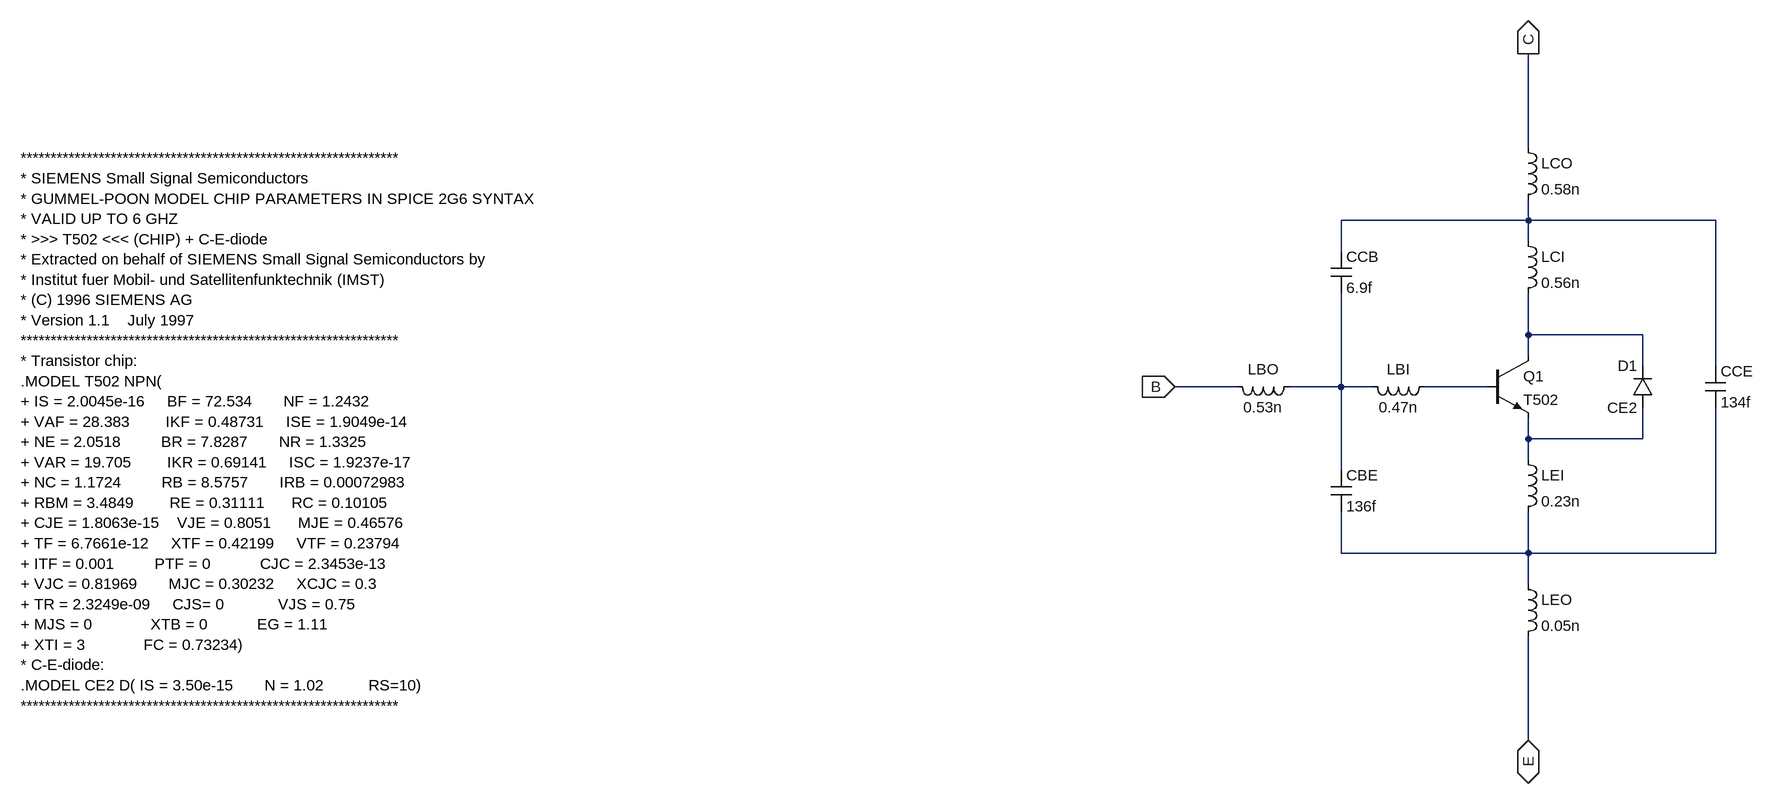
[diagram p0: schematic transistor.asc]
transistor.asc, the LTspice schematic file:
Version 4.1
SHEET 1 2192 680
WIRE 1840 -416 1840 -560
WIRE 1840 -304 1840 -336
WIRE 1840 -304 1552 -304
WIRE 2128 -304 1840 -304
WIRE 1840 -272 1840 -304
WIRE 1552 -256 1552 -304
WIRE 1840 -128 1840 -192
WIRE 2016 -128 1840 -128
WIRE 1840 -96 1840 -128
WIRE 2016 -80 2016 -128
WIRE 2128 -80 2128 -304
WIRE 1392 -48 1296 -48
WIRE 1552 -48 1552 -192
WIRE 1552 -48 1472 -48
WIRE 1600 -48 1552 -48
WIRE 1776 -48 1680 -48
WIRE 1840 32 1840 0
WIRE 2016 32 2016 -16
WIRE 2016 32 1840 32
WIRE 1840 64 1840 32
WIRE 1552 80 1552 -48
WIRE 1552 208 1552 144
WIRE 1840 208 1840 144
WIRE 1840 208 1552 208
WIRE 2128 208 2128 -16
WIRE 2128 208 1840 208
WIRE 1840 256 1840 208
WIRE 1840 496 1840 336
FLAG 1840 496 E
IOPIN 1840 496 BiDir
FLAG 1296 -48 B
IOPIN 1296 -48 In
FLAG 1840 -560 C
IOPIN 1840 -560 Out
SYMBOL npn 1776 -96 R0
SYMATTR InstName Q1
SYMATTR Value T502
SYMBOL ind 1824 48 R0
SYMATTR InstName LEI
SYMATTR Value 0.23n
SYMBOL ind 1824 240 R0
SYMATTR InstName LEO
SYMATTR Value 0.05n
SYMBOL ind 1824 -288 R0
SYMATTR InstName LCI
SYMATTR Value 0.56n
SYMBOL ind 1824 -432 R0
SYMATTR InstName LCO
SYMATTR Value 0.58n
SYMBOL ind 1696 -64 R90
WINDOW 0 5 56 VBottom 2
WINDOW 3 32 56 VTop 2
SYMATTR InstName LBI
SYMATTR Value 0.47n
SYMBOL ind 1488 -64 R90
WINDOW 0 5 56 VBottom 2
WINDOW 3 32 56 VTop 2
SYMATTR InstName LBO
SYMATTR Value 0.53n
SYMBOL cap 2112 -80 R0
SYMATTR InstName CCE
SYMATTR Value 134f
SYMBOL cap 1536 -256 R0
SYMATTR InstName CCB
SYMATTR Value 6.9f
SYMBOL cap 1536 80 R0
SYMATTR InstName CBE
SYMATTR Value 136f
SYMBOL diode 2032 -16 R180
WINDOW 0 24 64 Left 2
WINDOW 3 24 0 Left 2
SYMATTR InstName D1
SYMATTR Value CE2
TEXT -480 -400 Left 2 !***************************************************************\n* SIEMENS Small Signal Semiconductors\n* GUMMEL-POON MODEL CHIP PARAMETERS IN SPICE 2G6 SYNTAX\n* VALID UP TO 6 GHZ\n* >>> T502 <<< (CHIP) + C-E-diode\n* Extracted on behalf of SIEMENS Small Signal Semiconductors by\n* Institut fuer Mobil- und Satellitenfunktechnik (IMST)\n* (C) 1996 SIEMENS AG\n* Version 1.1    July 1997\n***************************************************************\n* Transistor chip:\n.MODEL T502 NPN(\n+ IS = 2.0045e-16     BF = 72.534       NF = 1.2432\n+ VAF = 28.383        IKF = 0.48731     ISE = 1.9049e-14\n+ NE = 2.0518         BR = 7.8287       NR = 1.3325\n+ VAR = 19.705        IKR = 0.69141     ISC = 1.9237e-17\n+ NC = 1.1724         RB = 8.5757       IRB = 0.00072983\n+ RBM = 3.4849        RE = 0.31111      RC = 0.10105\n+ CJE = 1.8063e-15    VJE = 0.8051      MJE = 0.46576\n+ TF = 6.7661e-12     XTF = 0.42199     VTF = 0.23794\n+ ITF = 0.001         PTF = 0           CJC = 2.3453e-13\n+ VJC = 0.81969       MJC = 0.30232     XCJC = 0.3\n+ TR = 2.3249e-09     CJS= 0            VJS = 0.75\n+ MJS = 0             XTB = 0           EG = 1.11\n+ XTI = 3             FC = 0.73234)\n* C-E-diode:\n.MODEL CE2 D( IS = 3.50e-15       N = 1.02          RS=10)\n***************************************************************

The netlist it stands for:
* transistor.asc
Q1 N002 N004 N005 0 T502
LEI N005 N006 0.23n
LEO N006 E 0.05n
LCI N001 N002 0.56n
LCO C N001 0.58n
LBI N004 N003 0.47n
LBO N003 B 0.53n
CCE N001 N006 134f
CCB N001 N003 6.9f
CBE N003 N006 136f
D1 N005 N002 CE2
.model D D
.lib standard.dio
.model NPN NPN
.model PNP PNP
.lib standard.bjt
***************************************************************
* SIEMENS Small Signal Semiconductors
* GUMMEL-POON MODEL CHIP PARAMETERS IN SPICE 2G6 SYNTAX
* VALID UP TO 6 GHZ
* >>> T502 <<< (CHIP) + C-E-diode
* Extracted on behalf of SIEMENS Small Signal Semiconductors by
* Institut fuer Mobil- und Satellitenfunktechnik (IMST)
* (C) 1996 SIEMENS AG
* Version 1.1    July 1997
***************************************************************
* Transistor chip:
.MODEL T502 NPN(
+ IS = 2.0045e-16     BF = 72.534       NF = 1.2432
+ VAF = 28.383        IKF = 0.48731     ISE = 1.9049e-14
+ NE = 2.0518         BR = 7.8287       NR = 1.3325
+ VAR = 19.705        IKR = 0.69141     ISC = 1.9237e-17
+ NC = 1.1724         RB = 8.5757       IRB = 0.00072983
+ RBM = 3.4849        RE = 0.31111      RC = 0.10105
+ CJE = 1.8063e-15    VJE = 0.8051      MJE = 0.46576
+ TF = 6.7661e-12     XTF = 0.42199     VTF = 0.23794
+ ITF = 0.001         PTF = 0           CJC = 2.3453e-13
+ VJC = 0.81969       MJC = 0.30232     XCJC = 0.3
+ TR = 2.3249e-09     CJS= 0            VJS = 0.75
+ MJS = 0             XTB = 0           EG = 1.11
+ XTI = 3             FC = 0.73234)
* C-E-diode:
.MODEL CE2 D( IS = 3.50e-15       N = 1.02          RS=10)
***************************************************************
.backanno
.end